# Altium schematic sheet ADC.SchDoc: PCB-Tester ADC
size A4; Date: JUN 2020; CheckedBy: Moerz, Hoeren; Author: Rudziński; CompanyName: TDK-Micronas GmbH; DrawnBy: Rudziński; Engineer: Rudziński; Organization: Test Engineering; Address1: Hans-Bunte-Strasse 19; Address2: D-79108 Freiburg; Address3: Germany; DocumentNumber: U33110; Revision: V1.0; SheetNumber: 3; SheetTotal: 18; DateDraw: JUN 2020; DateChecked: 2020-06-19; Workspace: Workspace; TitleTyp: Title-Typ; PageSetup: Record=PageOptions|CenterHorizontal=True|CenterVertical=True|PrintScale=0.97|XCorrection=1.00|YCorrection=1.00|PrintKind=0|BorderSize=5000000|LeftOffset=0|BottomOffset=0|Orientation=2|PaperLength=1000|PaperWidth=1000|Scale=100|PaperSource=7|PrintQuality=-3|MediaType=1|DitherType=10|PrintScaleMode=1|PaperKind=A4|PaperIndex=9
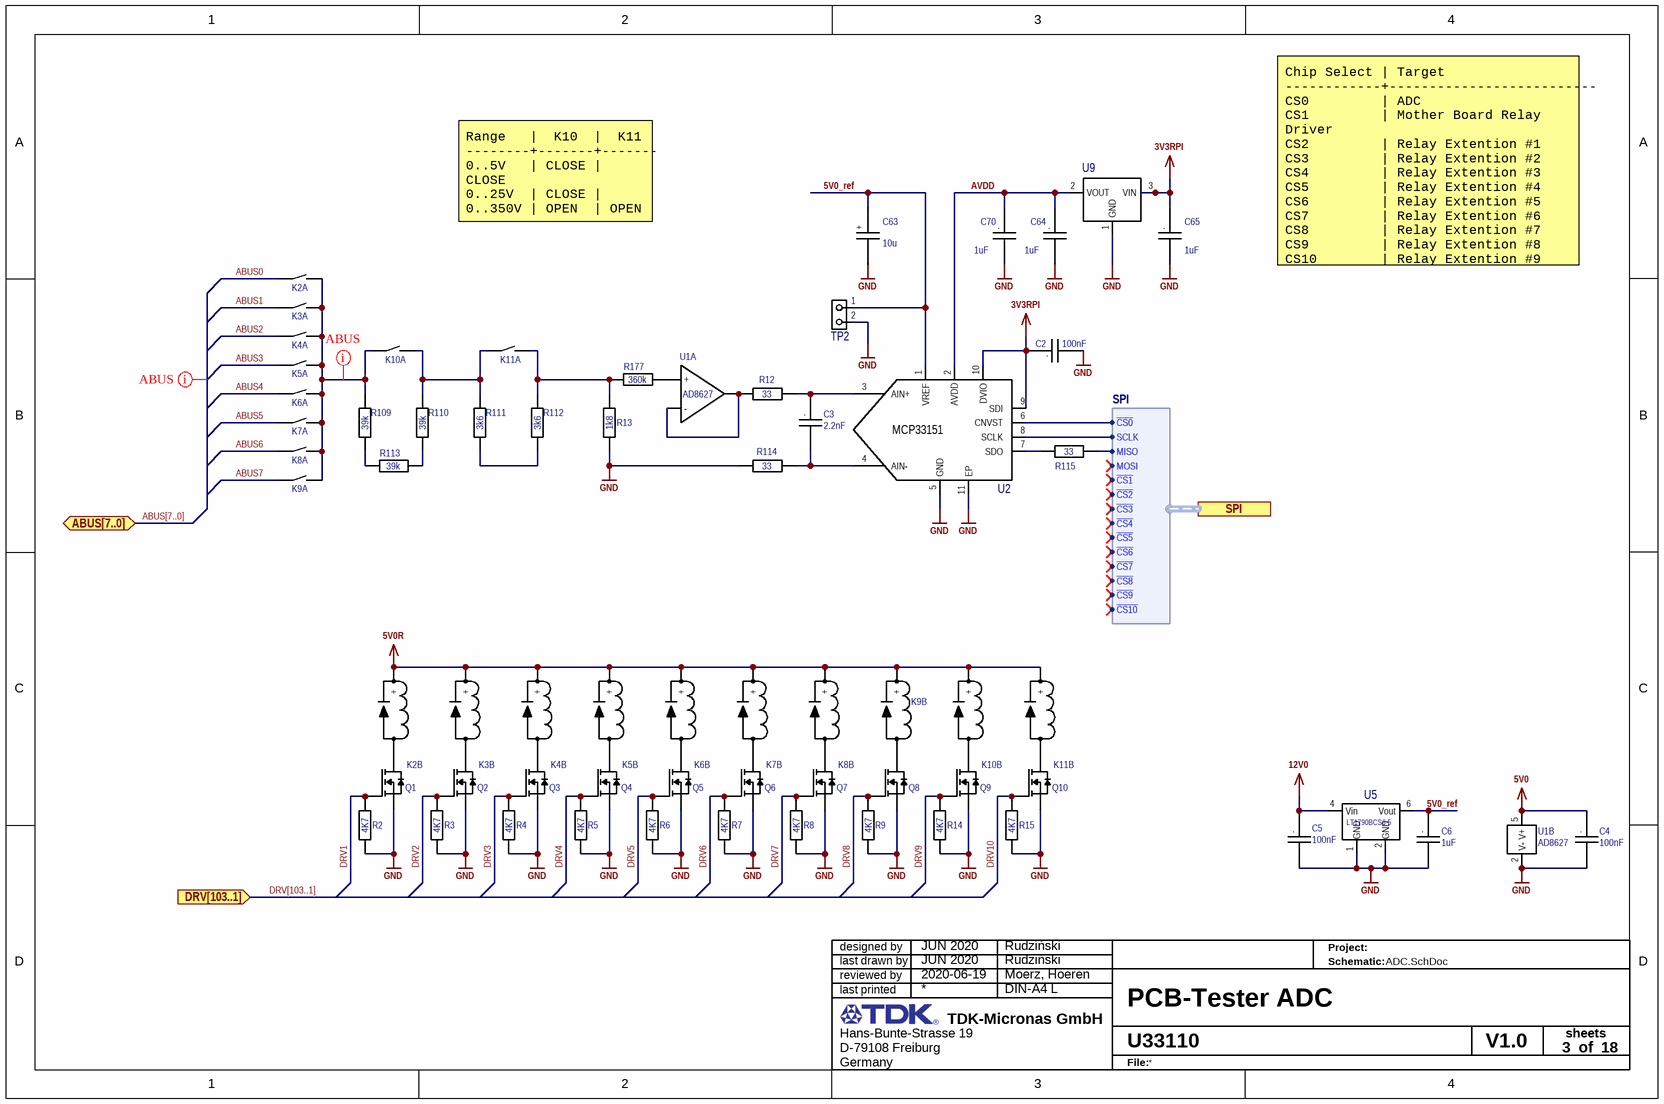
[diagram p0: ADC.SchDoc]

## Parts
C2  value 100nF  [C0402 Reflow]  (hidden comment: C)
C3  value 2.2nF  [C0603 Reflow]  (hidden comment: C)
C4  value 100nF  [C0402 Reflow]  (hidden comment: C)
C5  value 100nF  [C0402 Reflow]  (hidden comment: C)
C6  value 1uF  [C0402 Reflow]  (hidden comment: C)
C63  value 10u  [CAP_TAN_B]  (hidden comment: C+)
C64  value 1uF  [C0402 Reflow]  (hidden comment: C)
C65  value 1uF  [C0402 Reflow]  (hidden comment: C)
C70  value 1uF  [C0402 Reflow]  (hidden comment: C)
K2  K  [118-1A]  (value not drawn)  (parts A,B of 2)
K3  K  [118-1A]  (value not drawn)  (parts A,B of 2)
K4  K  [118-1A]  (value not drawn)  (parts A,B of 2)
K5  K  [118-1A]  (value not drawn)  (parts A,B of 2)
K6  K  [118-1A]  (value not drawn)  (parts A,B of 2)
K7  K  [118-1A]  (value not drawn)  (parts A,B of 2)
K8  K  [118-1A]  (value not drawn)  (parts A,B of 2)
K9  K  [118-1A]  (value not drawn)  (parts A,B of 2)
K10  K  [118-1A]  (value not drawn)  (parts A,B of 2)
K11  K  [118-1A]  (value not drawn)  (parts A,B of 2)
Q1  Q  [SOT23-3]  (value not drawn)
Q2  Q  [SOT23-3]  (value not drawn)
Q3  Q  [SOT23-3]  (value not drawn)
Q4  Q  [SOT23-3]  (value not drawn)
Q5  Q  [SOT23-3]  (value not drawn)
Q6  Q  [SOT23-3]  (value not drawn)
Q7  Q  [SOT23-3]  (value not drawn)
Q8  Q  [SOT23-3]  (value not drawn)
Q9  Q  [SOT23-3]  (value not drawn)
Q10  Q  [SOT23-3]  (value not drawn)
R2  value 4K7  [R0603 Reflow]  (hidden comment: R)
R3  value 4K7  [R0603 Reflow]  (hidden comment: R)
R4  value 4K7  [R0603 Reflow]  (hidden comment: R)
R5  value 4K7  [R0603 Reflow]  (hidden comment: R)
R6  value 4K7  [R0603 Reflow]  (hidden comment: R)
R7  value 4K7  [R0603 Reflow]  (hidden comment: R)
R8  value 4K7  [R0603 Reflow]  (hidden comment: R)
R9  value 4K7  [R0603 Reflow]  (hidden comment: R)
R12  value 33  [R0402 Reflow]  (hidden comment: R)
R13  value 1k8  [R0603 Reflow]  (hidden comment: R)
R14  value 4K7  [R0603 Reflow]  (hidden comment: R)
R15  value 4K7  [R0603 Reflow]  (hidden comment: R)
R109  value 39k  [R2512 Reflow]  (hidden comment: R)
R110  value 39k  [R2512 Reflow]  (hidden comment: R)
R111  value 3k6  [R0603 Reflow]  (hidden comment: R)
R112  value 3k6  [R0603 Reflow]  (hidden comment: R)
R113  value 39k  [R2512 Reflow]  (hidden comment: R)
R114  value 33  [R0402 Reflow]  (hidden comment: R)
R115  value 33  [R0402 Reflow]  (hidden comment: R)
R177  value 360k  [R1206 Reflow]  (hidden comment: R)
TP2  TP  [DualTestpoint 100mils]  (value not drawn)  (no BOM)
U1  U  [SC70-5]  (value not drawn)  (parts A,B of 2)
U2  NicName: MCP33151  [TDFN10EP]  (hidden comment: U)
U5  U  [TSOT23-6(S6)]  (value not drawn)
U9  U  [SOT23-3]  (value not drawn)

## Ports
ABUS[7..0] (bidir), DRV[103..1] (in), SPI (harness SPI)

## Harnesses
SPI: MISO, MOSI, SCLK, ~{CS0}, ~{CS1}, ~{CS2}, ~{CS3}, ~{CS4}, ~{CS5}, ~{CS6}, ~{CS7}, ~{CS8}, ~{CS9}, ~{CS10}

## Nets
3V3RPI: C2.1 C65.1 U2.9(SDI) U2.10(DVIO) U9.3(VIN)
5V0: C4.1 U1.5(V+)
5V0R: K2.1(+) K3.1(+) K4.1(+) K5.1(+) K6.1(+) K7.1(+) K8.1(+) K9.1(+) K10.1(+) K11.1(+)
12V0: C5.1 U5.4(Vin)
GND: C2.2 C4.2 C5.2 C6.2 C63.2 C64.2 C65.2 C70.2 Q1.2(S) Q2.2(S) Q3.2(S) Q4.2(S) Q5.2(S) Q6.2(S) Q7.2(S) Q8.2(S) Q9.2(S) Q10.2(S) R2.1 R3.1 R4.1 R5.1 R6.1 R7.1 R8.1 R9.1 R13.1 R14.1 R15.1 R114.2 TP2.2 U1.2(V-) U2.5(GND) U2.11(EP) U5.1(GND) U5.2(GND) U9.1(GND)
5V0_ref: C6.1 C63.1 TP2.1 U2.1(VREF) U5.6(Vout)
ABUS0: K2.4(CB)
ABUS1: K3.4(CB)
ABUS2: K4.4(CB)
ABUS3: K5.4(CB)
ABUS4: K6.4(CB)
ABUS5: K7.4(CB)
ABUS6: K8.4(CB)
ABUS7: K9.4(CB)
AVDD: C64.1 C70.1 U2.2(AVDD) U9.2(VOUT)
DRV1: Q1.1(G) R2.2
DRV2: Q2.1(G) R3.2
DRV3: Q3.1(G) R4.2
DRV4: Q4.1(G) R5.2
DRV5: Q5.1(G) R6.2
DRV6: Q6.1(G) R7.2
DRV7: Q7.1(G) R8.2
DRV8: Q8.1(G) R9.2
DRV9: Q9.1(G) R14.2
DRV10: Q10.1(G) R15.2
NetC3_1: C3.1 R12.1 U2.3(AIN+)
NetC3_2: C3.2 R114.1 U2.4(AIN-)
NetK2_2: K2.2(-) Q1.3(D)
NetK2_3: K2.3(CA) K3.3(CA) K4.3(CA) K5.3(CA) K6.3(CA) K7.3(CA) K8.3(CA) K9.3(CA) K10.4(CB) R109.2
NetK3_2: K3.2(-) Q2.3(D)
NetK4_2: K4.2(-) Q3.3(D)
NetK5_2: K5.2(-) Q4.3(D)
NetK6_2: K6.2(-) Q5.3(D)
NetK7_2: K7.2(-) Q6.3(D)
NetK8_2: K8.2(-) Q7.3(D)
NetK9_2: K9.2(-) Q8.3(D)
NetK10_2: K10.2(-) Q9.3(D)
NetK10_3: K10.3(CA) K11.4(CB) R110.2 R111.2
NetK11_2: K11.2(-) Q10.3(D)
NetK11_3: K11.3(CA) R13.2 R112.2 R177.2
NetR12_2: R12.2 U1.1(Out) U1.4(-)
NetR109_1: R109.1 R113.2
NetR110_1: R110.1 R113.1
NetR111_1: R111.1 R112.1
NetR115_1: R115.1 U2.7(SDO)
NetR115_2: R115.2 ; port SPI.MISO
NetR177_1: R177.1 U1.3(+)
NetU2_6: U2.6(CNVST) ; port SPI.~{CS0}
NetU2_8: U2.8(SCLK) ; port SPI.SCLK

## Buses and harness runs
bus ABUS[7..0] = port ABUS[7..0]
bus DRV[103..1] = port DRV[103..1]

## Layout directives
net class ABUS: (no net found under the mark), NetK2_3

## Notes on the sheet
- Range   |  K10  |  K11
  --------+-------+-------
  0..5V   | CLOSE | CLOSE
  0..25V  | CLOSE |
  0..350V | OPEN  | OPEN
- Chip Select | Target
  ------------+--------------------------
  CS0         | ADC
  CS1         | Mother Board Relay Driver
  CS2         | Relay Extention #1
  CS3         | Relay Extention #2
  CS4         | Relay Extention #3
  CS5         | Relay Extention #4
  CS6         | Relay Extention #5
  CS7         | Relay Extention #6
  CS8         | Relay Extention #7
  CS9         | Relay Extention #8
  CS10        | Relay Extention #9
- designed by
- reviewed by
- last drawn by
- Project:
- Schematic:
- last printed
- DIN-A4 L
- sheets
- of
- File:
- (in symbol C) .
- (in symbol C+_TAN) +

## Library data of the parts
C2 C4 C5 = C: CAP CER 0.1UF 25V X7R 0402; 04. Manufacturer: Yageo; 07. Manufacturer  Part Number: CC0402KRX7R8BB104; Tolerance: ±5%; Voltage Rating: 16V; 03. Unit Price: 0.09; 13. Created Date/Name: AUG2018/Hören; Type: X7R; ComponentLink1Description: Info; ComponentLink1URL: https://www.digikey.de/product-detail/en/kemet/C0402C104J4RACTU/399-7761-6-ND/3472292; 02. Distributor Part Number: 311-2077-6-ND; 09. Operating Temperature: -55°C ~ 125°C; 11. RoHS: YES; 01. Distributor: DigiKey; ComponentLink2Description: DataSheet; ComponentLink2URL: https://content.kemet.com/datasheets/KEM_C1002_X7R_SMD.pdf; Package: 0402
C3 = C: CAP CER 2200PF 50V X7R 0402; 04. Manufacturer: Samsung Electro-Mechanics; 07. Manufacturer  Part Number: CL05B222JB5NNNC; Tolerance: ±5%; 03. Unit Price: 0.09; 13. Created Date/Name: AUG2018/Hören; Voltage Rating: 50V; Type: X7R; ComponentLink1Description: Info; ComponentLink1URL: https://www.digikey.de/product-detail/en/samsung-electro-mechanics/CL05B222JB5NNNC/1276-1532-6-ND/3892046; 02. Distributor Part Number: 1276-1532-6-ND; 09. Operating Temperature: -55°C ~ 125°C; 11. RoHS: YES; 01. Distributor: DigiKey; ComponentLink2Description: DataSheet; Package: 0402
C6 C64 C65 C70 = C: CAP CER 1UF 6.3V X7R 0402; 04. Manufacturer: Murata Electronics; 07. Manufacturer  Part Number: GRM155R70J105KA12J; Tolerance: ±10%; 03. Unit Price: 0.11; 13. Created Date/Name: AUG2018/Hören; Voltage Rating: 6.3V; Type: X7R; ComponentLink1Description: Info; ComponentLink1URL: https://www.digikey.de/product-detail/en/murata-electronics/GRM155R70J105KA12J/490-13339-6-ND/5973468; 02. Distributor Part Number: 490-13339-6-ND; 09. Operating Temperature: -55°C ~ 125°C; 11. RoHS: YES; 01. Distributor: DigiKey; ComponentLink2Description: DataSheet; Package: 0402
C63 = C+_TAN: CAP TANT 10UF 20% 16V 1411; 04. Manufacturer: Vishay Sprague; 07. Manufacturer  Part Number: TMCHB1C106MTRF; 03. Unit Price: 0.4; 3D-Export: No; ComponentLink1Description: Info; 02. Distributor Part Number: 718-2344-1-ND; 11. RoHS: YES; 01. Distributor: DigiKey; ComponentLink2Description: DataSheet
K2-K11 = 118-1-A-5/2D: 5V Signal Relais, Normal Open; 04. Manufacturer: Pickering; 03. Unit Price: 2.60; 05. Quantity: 1000; 06. Data Sheet: Pickering_series_118.pdf; 13. Created Date/Name: 20.12.17 S. Kaiser; Coil Resistance: 1500 Ohm; Max Carry Current: 1.2 A; Max Switch Current: 1A; Max Switch Voltage: 200V; Power Rating: 15W; 01. Distributor: Pickering; 02. Distributor Part Number: 118-1-A-5/2D; 07. Manufacturer  Part Number: 118-1-A-5/2D; 09. Operating Temperature: -20°C ~ +85°C; 11. RoHS: 2011/65/EU; ComponentLink1Description: Info; ComponentLink1URL: http://www.pickeringrelay.com/; ComponentLink2Description: DataSheet; ComponentLink2URL: https://www.pickeringrelay.com/products/single-line-sil-series-111-119/single-line-sil-series-118/; Coil Voltage: 5V
Q1-Q10 = FDV303N: MOSFET N-CH 25V 680MA SOT-23; 04. Manufacturer: ON Semiconductor; 03. Unit Price: 0.41; 13. Created Date/Name: AUG 2018 / Hören; Rds On: 450 mΩ @ id=500mA & Vgs=4.5V; Vgs,th: 1.5V @ 250uA; Power Rating: 350mW; 3D-Export: No; 01. Distributor: DigiKey; 02. Distributor Part Number: FDV303NDKR-ND; 07. Manufacturer  Part Number: FDV303N; 09. Operating Temperature: -55°C ~ 150°C (TJ); 11. RoHS: YES; ComponentLink1Description: Info; ComponentLink1URL: https://www.digikey.de/product-detail/en/on-semiconductor/FDV303N/FDV303NDKR-ND/1630434; ComponentLink2Description: DataSheet; ComponentLink2URL: https://media.digikey.com/pdf/Data%20Sheets/Fairchild%20PDFs/FDV303N.pdf; Vdss: 25V; Id: 680mA
R2-R9 R14 R15 = R: RES SMD 4.7K OHM 1% 1/10W 0603; 04. Manufacturer: Yageo; 07. Manufacturer  Part Number: RC0603FR-074K7L; 03. Unit Price: 0.09; 13. Created Date/Name: AUG2018/Hören; Tolerance: ±1%; ComponentLink1URL: *; ComponentLink1Description: Info; 02. Distributor Part Number: 311-4.70KHRCT-ND; 09. Operating Temperature: -xx..+yy°C; 11. RoHS: ???; 01. Distributor: DigiKey; ComponentLink2Description: DataSheet; Package: *
R12 R114 = R: RES SMD 33 OHM 1% 1/16W 0402; 04. Manufacturer: Yageo; 07. Manufacturer  Part Number: RC0402FR-0733RL; 03. Unit Price: 0.09; 13. Created Date/Name: AUG2018/Hören; Power Rating: 0.1W; Tolerance: ±1%; ComponentLink1URL: https://www.digikey.de/product-detail/en/panasonic-electronic-components/ERJ-2RKF15R0X/P15.0LDKR-ND/575530; ComponentLink1Description: Info; 02. Distributor Part Number: 311-33.0LRDKR-ND; 09. Operating Temperature: -55°C ~ 155°C; 11. RoHS: YES; 01. Distributor: DigiKey; ComponentLink2Description: DataSheet; ComponentLink2URL: https://industrial.panasonic.com/cdbs/www-data/pdf/RDA0000/AOA0000C304.pdf; Type: Thick Film; Package: 0402
R13 = R: RES SMD 1.8K OHM 1% 1/16W 0402; 04. Manufacturer: Yageo; 07. Manufacturer  Part Number: RC0402FR-071K8L; 03. Unit Price: 0.09; 13. Created Date/Name: AUG2018/Hören; Tolerance: ±1%; ComponentLink1URL: *; ComponentLink1Description: Info; 02. Distributor Part Number: 311-1.80KLRCT-ND; 09. Operating Temperature: -xx..+yy°C; 11. RoHS: ???; 01. Distributor: DigiKey; ComponentLink2Description: DataSheet; Package: *
R109 R110 R113 = R: CRGP 2512 39K 1%; 04. Manufacturer: TE Connectivity Passive Product; 07. Manufacturer  Part Number: CRGP2512F39K; 03. Unit Price: 0.44; 13. Created Date/Name: AUG2018/Hören; Tolerance: ±1%; ComponentLink1URL: *; ComponentLink1Description: Info; 02. Distributor Part Number: A130740CT-ND; 09. Operating Temperature: -xx..+yy°C; 11. RoHS: ???; 01. Distributor: DigiKey; ComponentLink2Description: DataSheet; Package: *
R111 R112 = R: RES SMD 3.6K OHM 1% 1/10W 0603; 04. Manufacturer: Yageo; 07. Manufacturer  Part Number: RC0603FR-073K6L; 03. Unit Price: 0.09; 13. Created Date/Name: AUG2018/Hören; Tolerance: ±1%; ComponentLink1URL: *; ComponentLink1Description: Info; 02. Distributor Part Number: 311-3.60KHRCT-ND; 09. Operating Temperature: -xx..+yy°C; 11. RoHS: ???; 01. Distributor: DigiKey; ComponentLink2Description: DataSheet; Package: *
R115 = R_19: RES SMD 33 OHM 1% 1/16W 0402; 04. Manufacturer: Yageo; 07. Manufacturer  Part Number: RC0402FR-0733RL; 03. Unit Price: 0.09; 13. Created Date/Name: AUG2018/Hören; Power Rating: 63mW; Tolerance: ±1%; ComponentLink1URL: https://www.digikey.de/products/en?keywords=311-33.0LRDKR-ND; ComponentLink1Description: Info; 02. Distributor Part Number: 311-33.0LRDKR-ND; 09. Operating Temperature: -55°C ~ 155°C; 11. RoHS: YES; 01. Distributor: DigiKey; ComponentLink2Description: DataSheet; Type: Thick Film; Package: 0402
R177 = R: RES SMD 360K OHM 1% 1/4W 1206; 04. Manufacturer: Yageo; 07. Manufacturer  Part Number: RC1206FR-07360KL; 03. Unit Price: 0.09; 13. Created Date/Name: AUG2018/Hören; Tolerance: ±1%; ComponentLink1URL: *; ComponentLink1Description: Info; 02. Distributor Part Number: 311-360KFRCT-ND; 09. Operating Temperature: -xx..+yy°C; 11. RoHS: ???; 01. Distributor: DigiKey; ComponentLink2Description: DataSheet; Package: *
TP2 = DualTestpoint 100mils: Dual testpoint, pitch 2.54mm; 04. Manufacturer: Samtec Inc.; 07. Manufacturer  Part Number: HMTSW-103-07-G-S-240; 03. Unit Price: 0.25; 13. Created Date/Name: AUG2018/Hören; 01. Distributor: Samtec Inc.; 02. Distributor Part Number: HMTSW-103-07-G-S-240; 11. RoHS: YES; ComponentLink1Description: Info; ComponentLink1URL: https://www.samtec.com/products/hmtsw-103-07-g-s-240; ComponentLink2Description: DataSheet; ComponentLink2URL: http://suddendocs.samtec.com/catalog_english/hmtsw.pdf
U1 = AD8627: IC OPAMP JFET 5MHZ RRO SC70-5; 04. Manufacturer: Analog Devices Inc.; 07. Manufacturer  Part Number: AD8627AKSZ-R2; 03. Unit Price: 5.15; 13. Created Date/Name: AUG 2018 / Hören; 01. Distributor: DigiKey; 02. Distributor Part Number: AD8627AKSZ-R2DKR-ND; 09. Operating Temperature: -40°C ~ 85°C; 11. RoHS: YES; ComponentLink1Description: Info; ComponentLink1URL: https://www.digikey.de/product-detail/en/analog-devices-inc/AD8627AKSZ-R2/AD8627AKSZ-R2DKR-ND/3878640; ComponentLink2Description: DataSheet; ComponentLink2URL: http://www.analog.com/media/en/technical-documentation/data-sheets/AD8625_8626_8627.pdf; Package: SC70-5; Part: AD8627
U2 = MCP33151-10T-E/MN: 14-BIT 1 MSPS SGL CH SGL-ENDED S; 04. Manufacturer: Microchip Technology; 03. Unit Price: 4.5; 13. Created Date/Name: AUG 2018 / Hören; 01. Distributor: DigiKey; 02. Distributor Part Number: MCP33151-10T-E/MNDKR-ND; 07. Manufacturer  Part Number: MCP33151-10T-E/MN; 11. RoHS: YES; ComponentLink1Description: Info; ComponentLink1URL: https://www.digikey.de/product-detail/en/microchip-technology/MCP33151-10T-E-MN/MCP33151-10T-E-MNDKR-ND/10270414; ComponentLink2Description: DataSheet; ComponentLink2URL: http://ww1.microchip.com/downloads/en/DeviceDoc/MCP33151-XX-Family-Data-Sheet-DS20006220A.pdf; Package: 10-WFDFN Exposed Pad
U5 = LT1790BCS6-5: IC VREF SERIES 5V, 0.1% TSOT-23-6; 04. Manufacturer: Linear Technology/Analog Devices; 07. Manufacturer  Part Number: LT1790BCS6-5#TRMPBF; 03. Unit Price: 2.86; 13. Created Date/Name: AUG 2018 / Hören; 01. Distributor: DigiKey; 02. Distributor Part Number: LT1790BCS6-5#TRMPBFDKR-ND; 09. Operating Temperature: 0°C ~ 70°C (TA); 11. RoHS: YES; ComponentLink1Description: Info; ComponentLink1URL: https://www.digikey.de/product-detail/en/linear-technology-analog-devices/LT1790BCS6-5-TRMPBF/LT1790BCS6-5-TRMPBFDKR-ND/1618066; ComponentLink2Description: DataSheet; ComponentLink2URL: https://www.analog.com/media/en/technical-documentation/data-sheets/1790fc.pdf; NicName: LT1790BCS6-5
U9 = AP2138N: IC REG LINEAR 1.8V 250MA SOT23-3; 04. Manufacturer: Diodes Incorporated; 07. Manufacturer  Part Number: AP2138N-1.8TRG1; 03. Unit Price: 0.43; 01. Distributor: DigiKey; 02. Distributor Part Number: AP2138N-1.8TRG1DICT-ND; 11. RoHS: YES; ComponentLink1Description: Info; ComponentLink2Description: DataSheet